# Altium schematic sheet PowerICs.SchDoc
size A; SheetNumber: 7; SheetTotal: 11
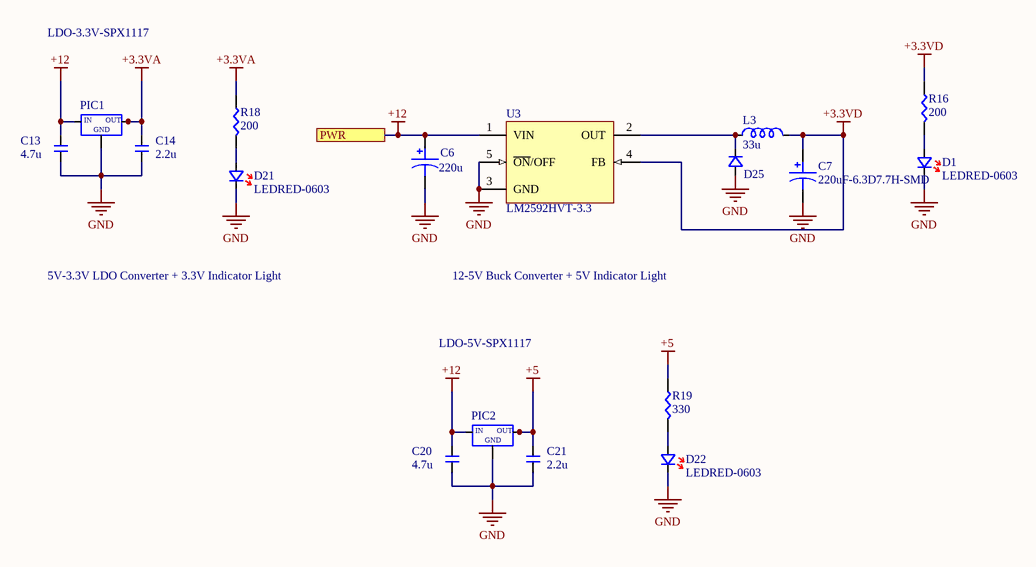
[diagram p0: PowerICs.SchDoc]

## Parts
C6  220u  [CAP-6.3D7.7H-SMD]
C7  220uF-6.3D7.7H-SMD  [CAP-6.3D7.7H-SMD]
C13  4.7u  [CAP-0603]
C14  2.2u  [CAP-0603]
C20  4.7u  [CAP-0603]
C21  2.2u  [CAP-0603]
D1  LEDRED-0603  [LEDRED-0603]
D21  LEDRED-0603  [LEDRED-0603]
D22  LEDRED-0603  [LEDRED-0603]
D25  (no value)  [SOD123]
L3  33u  [IND-6045]
PIC1  LDO-3.3V-SPX1117  [SOT223]
PIC2  LDO-5V-SPX1117  [SOT223]
R16  200  [RES-0603]
R18  200  [RES-0603]
R19  330  [RES-0603]
U3  LM2592HVT-3.3  [T05D]

## Ports
PWR

## Nets
+3.3VA: C14.2 PIC1.2 PIC1.4 R18.1
+3.3VD: C7.POS(+) L3.2 R16.1 U3.4(FB)
+5: C21.2 PIC2.2 PIC2.4 R19.1
+12: C6.POS(+) C13.2 C20.2 PIC1.3 PIC2.3 U3.1(VIN) ; port PWR
GND: C6.NEG(-) C7.NEG(-) C13.1 C14.1 C20.1 C21.1 D1.K D21.K D22.K D25.A PIC1.1 PIC2.1 U3.3(GND) U3.5(~{ON}/OFF)
NetD1_A: D1.A R16.2
NetD21_A: D21.A R18.2
NetD22_A: D22.A R19.2
NetD25_K: D25.K L3.1 U3.2(OUT)

## Notes on the sheet
- 5V-3.3V LDO Converter + 3.3V Indicator Light
- 12-5V Buck Converter + 5V Indicator Light
- (in symbol LDO-SOT223_SPX1117) IN; OUT; GND

## Library data of the parts
C6 = CAP-6.3D7.7H-SMD: 220uF-6.3D7.7H-SMD / 25v, 600ma Ripple
C7 = CAP-6.3D7.7H-SMD
C13 C14 C20 C21 = CAP-0603
D25 = DIODE-SOD123
L3 = IND-6045
PIC1 PIC2 = LDO-SOT223_SPX1117
R16 R18 R19 = RES-0603
U3 = CMP-0069-01883-2: SIMPLE SWITCHER® Power Converter 150 KHz 2A Step-Down Voltage Regulator, 5-pin TO-220; Manufacturer: National Semiconductor; PackageTopMarking: NSUZXYTTE#*LM2592HVT*-3.3 P+; PowerWise: N; ComponentLink3Description: T05D Package Page; PackageReference: T05D; DatasheetVersion: Aug-2001; RoHS: N; PackageDescription: TO-220, Molded, Stagger Bend, 5 Lead; ComponentLink2Description: LM2592HV Web Page; RevisionNote: Component URLs added; ComponentLink2URL: http://www.national.com/pf/LM/LM2592HV.html; CompType: Switcher; ComponentLink1Description: LM2592HV Datasheet; PinCount: 5; ComponentLink1URL: http://www.national.com/ds/LM/LM2592HV.pdf; PackageVersion: revA, Oct-1989; ComponentLink3URL: http://www.national.com/packaging/folders/t05d.html